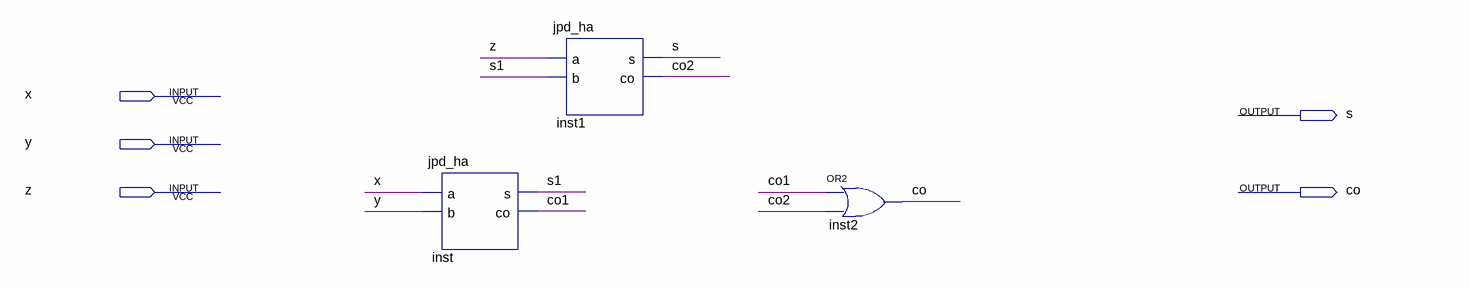
[diagram p0: schematic sheet]
// Quartus schematic jpd_fa.bdf as structural Verilog: 3 symbols, 5 pins
module jpd_fa (
  input  x,
  input  y,
  input  z,
  output s,
  output co
);

  wire co1, co2, s1;

  jpd_ha inst (.a(x), .b(y), .s(s1), .co(co1));
  jpd_ha inst1 (.a(z), .b(s1), .s(s), .co(co2));
  or inst2 (co, co1, co2);
endmodule
